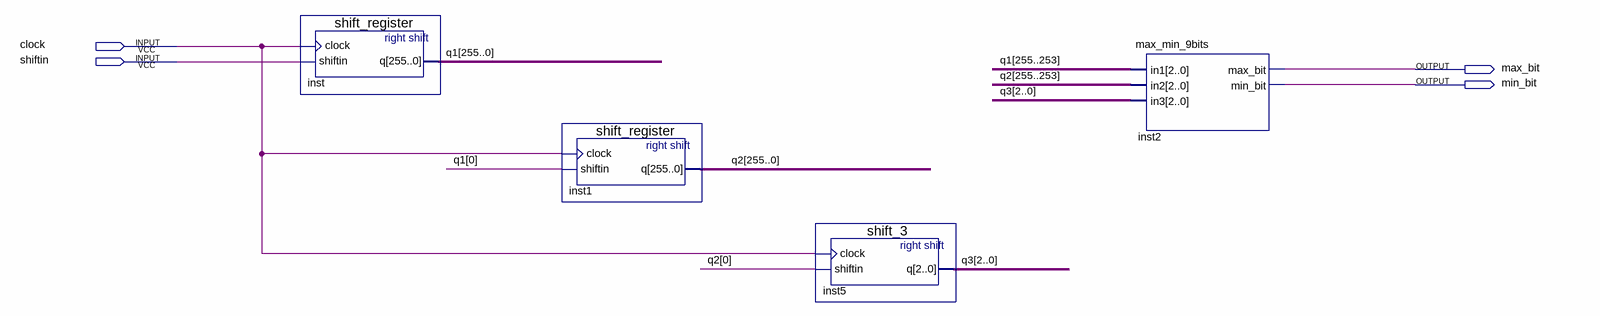
[diagram p0: schematic sheet]
// Quartus schematic modulo_sal_e_pimenta.bdf as structural Verilog: 4 symbols, 4 pins
module modulo_sal_e_pimenta (
  input  clock,
  input  shiftin,
  output max_bit,
  output min_bit
);

  wire [2:0] q3;
  wire [255:0] q1, q2;

  shift_register inst (.clock(clock), .shiftin(shiftin), .q(q1));
  shift_register inst1 (.clock(clock), .shiftin(q1[0]), .q(q2));
  shift_3 inst5 (.clock(clock), .shiftin(q2[0]), .q(q3));
  max_min_9bits inst2 (.in1(q1[255:253]), .in2(q2[255:253]), .in3(q3), .max_bit(max_bit), .min_bit(min_bit));
endmodule
